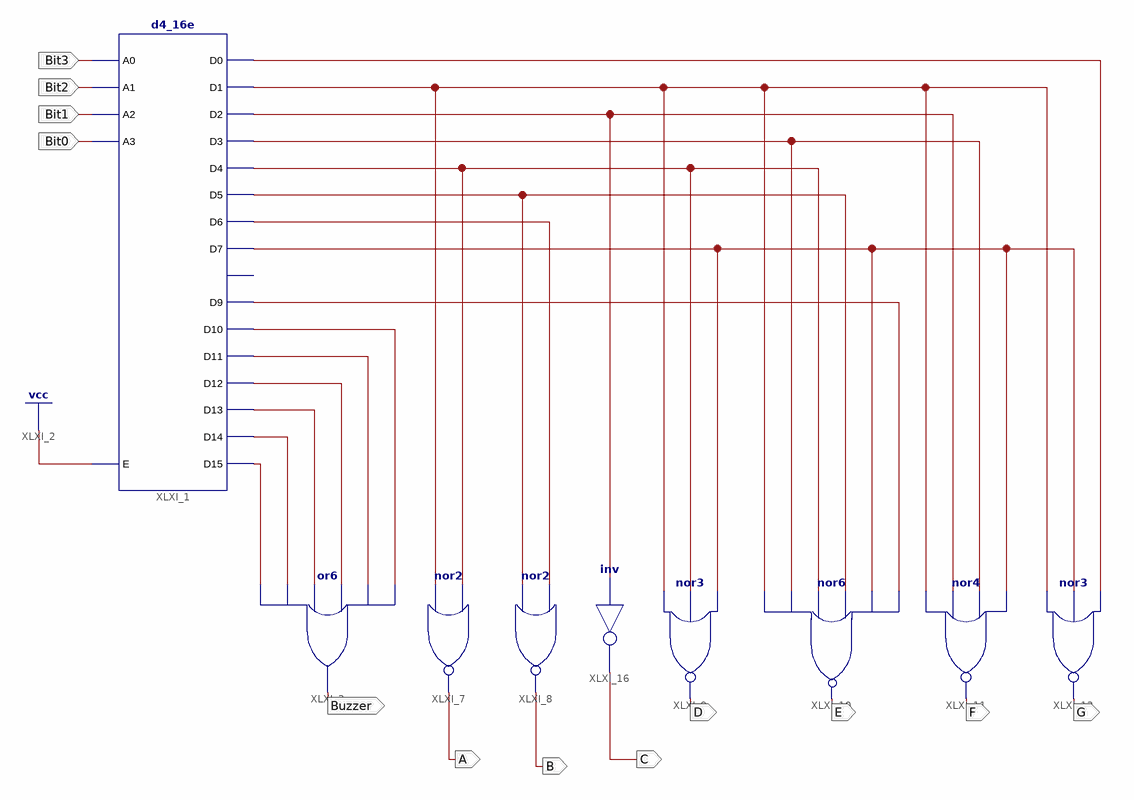
[diagram p0: schematic sheet 1]
// Xilinx ISE schematic BCD_7SEG.sch (spartan6) as structural Verilog: 9 symbols, 12 ports
module BCD_7SEG (
  input  Bit3,
  input  Bit2,
  input  Bit1,
  input  Bit0,
  output C,
  output Buzzer,
  output A,
  output B,
  output G,
  output F,
  output E,
  output D
);

  wire XLXN_6, XLXN_7, XLXN_10, XLXN_11, XLXN_12, XLXN_13, XLXN_14, XLXN_17, XLXN_21, XLXN_22, XLXN_23,
       XLXN_24, XLXN_25, XLXN_26, XLXN_32;

  d4_16e XLXI_1 (
    .A0(Bit3), .A1(Bit2), .A2(Bit1), .A3(Bit0), .E(1'b1), .D0(XLXN_6), .D1(XLXN_7), .D10(XLXN_26),
    .D11(XLXN_25), .D12(XLXN_24), .D13(XLXN_23), .D14(XLXN_22), .D15(XLXN_21), .D2(XLXN_32), .D3(XLXN_10),
    .D4(XLXN_11), .D5(XLXN_12), .D6(XLXN_13), .D7(XLXN_14), .D9(XLXN_17));  // open: D8
  or XLXI_3 (Buzzer, XLXN_21, XLXN_22, XLXN_23, XLXN_24, XLXN_25, XLXN_26);
  nor XLXI_7 (A, XLXN_7, XLXN_11);
  nor XLXI_8 (B, XLXN_12, XLXN_13);
  nor XLXI_9 (D, XLXN_7, XLXN_11, XLXN_14);
  nor XLXI_10 (E, XLXN_7, XLXN_10, XLXN_11, XLXN_12, XLXN_14, XLXN_17);
  nor XLXI_11 (F, XLXN_7, XLXN_32, XLXN_10, XLXN_14);
  nor XLXI_12 (G, XLXN_7, XLXN_14, XLXN_6);
  not XLXI_16 (C, XLXN_32);
endmodule
